# EAGLE design ElectromagnetArray_V01 (EAGLE 9.0.1)
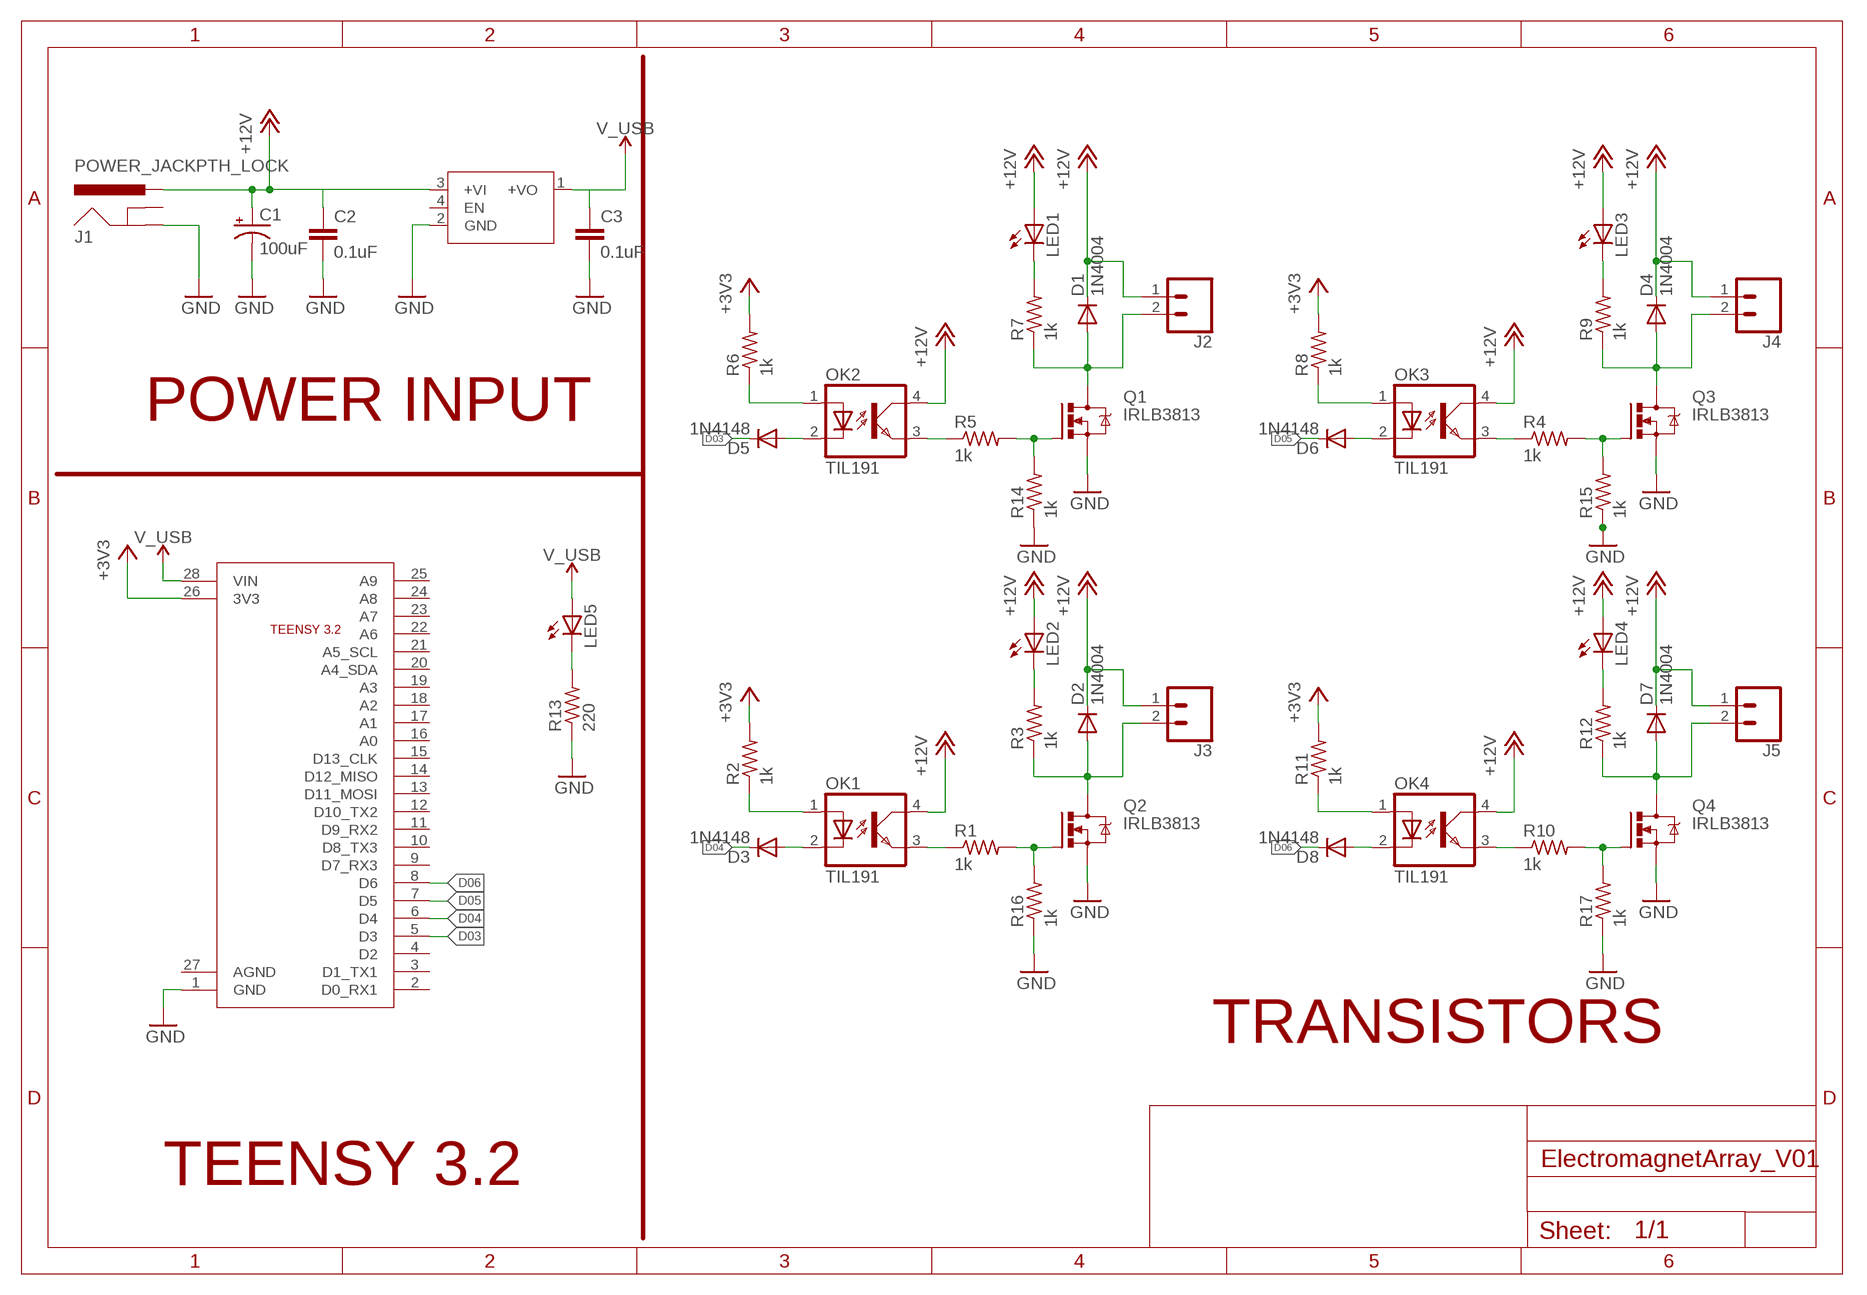
[diagram p0: schematic, sheet 1]

## Parts
C1  100uF  CPOL-USE3.5-8  [E3,5-8]
C2  0.1uF  C-EU050-025X075  [C050-025X075]
C3  0.1uF  C-EU050-025X075  [C050-025X075]
D1  1N4004  [DO41-10]
D2  1N4004  [DO41-10]
D3  1N4148  1N4148DO35-10  [DO35-10]
D4  1N4004  [DO41-10]
D5  1N4148  1N4148DO35-10  [DO35-10]
D6  1N4148  1N4148DO35-10  [DO35-10]
D7  1N4004  [DO41-10]
D8  1N4148  1N4148DO35-10  [DO35-10]
J1  POWER_JACKPTH_LOCK  [POWER_JACK_PTH_LOCK]
J2  CONN_025MM  [SCREWTERMINAL-5MM-2]
J3  CONN_025MM  [SCREWTERMINAL-5MM-2]
J4  CONN_025MM  [SCREWTERMINAL-5MM-2]
J5  CONN_025MM  [SCREWTERMINAL-5MM-2]
LED1  LED5MM  [LED5MM]
LED2  LED5MM  [LED5MM]
LED3  LED5MM  [LED5MM]
LED4  LED5MM  [LED5MM]
LED5  LED5MM  [LED5MM]
OK1  TIL191  [DIL04]
OK2  TIL191  [DIL04]
OK3  TIL191  [DIL04]
OK4  TIL191  [DIL04]
Q1  IRLB3813  IRF740  [TO220BV]
Q2  IRLB3813  IRF740  [TO220BV]
Q3  IRLB3813  IRF740  [TO220BV]
Q4  IRLB3813  IRF740  [TO220BV]
R1  1k  R-US_0204/7  [0204/7]
R2  1k  R-US_0204/7  [0204/7]
R3  1k  R-US_0204/7  [0204/7]
R4  1k  R-US_0204/7  [0204/7]
R5  1k  R-US_0204/7  [0204/7]
R6  1k  R-US_0204/7  [0204/7]
R7  1k  R-US_0204/7  [0204/7]
R8  1k  R-US_0204/7  [0204/7]
R9  1k  R-US_0204/7  [0204/7]
R10  1k  R-US_0204/7  [0204/7]
R11  1k  R-US_0204/7  [0204/7]
R12  1k  R-US_0204/7  [0204/7]
R13  220  R-US_0204/7  [0204/7]
R14  1k  R-US_0204/7  [0204/7]
R15  1k  R-US_0204/7  [0204/7]
R16  1k  R-US_0204/7  [0204/7]
R17  1k  R-US_0204/7  [0204/7]
U$1  TEENSY3.2  [TEENSY]
U$2  SMPS_SMALL  [SMPS_SMALL]

## Nets
+3V3: R2.2 R6.2 R8.2 R11.2 U$1.26(3V3)
+12V: C1.+ C2.1 D1.C D2.C D4.C D7.C J1.PWR J2.1 J3.1 J4.1 J5.1 LED1.A LED2.A LED3.A LED4.A OK1.4(COL) OK2.4(COL) OK3.4(COL) OK4.4(COL) U$2.3(+VI)
D03: D5.C U$1.5(D3)
D04: D3.C U$1.6(D4)
D05: D6.C U$1.7(D5)
D06: D8.C U$1.8(D6)
GND: C1.- C2.2 C3.2 J1.GND Q1.S Q2.S Q3.S Q4.S R13.1 R14.1 R15.1 R16.1 R17.1 U$1.1(GND) U$2.2(GND)
N$1: Q1.G R5.2 R14.2
N$2: D2.A J3.2 Q2.D R3.1
N$3: OK1.3(EMIT) R1.1
N$4: OK1.1(A) R2.1
N$5: D3.A OK1.2(C)
N$6: LED2.K(C) R3.2
N$7: Q2.G R1.2 R16.2
N$8: D4.A J4.2 Q3.D R9.1
N$9: D1.A J2.2 Q1.D R7.1
N$10: LED1.K(C) R7.2
N$11: OK3.3(EMIT) R4.1
N$12: OK2.3(EMIT) R5.1
N$13: OK2.1(A) R6.1
N$14: D5.A OK2.2(C)
N$15: OK3.1(A) R8.1
N$16: D6.A OK3.2(C)
N$17: LED3.K(C) R9.2
N$19: D7.A J5.2 Q4.D R12.1
N$20: OK4.3(EMIT) R10.1
N$21: OK4.1(A) R11.1
N$22: D8.A OK4.2(C)
N$23: LED4.K(C) R12.2
N$24: Q4.G R10.2 R17.2
N$25: LED5.K(C) R13.2
N$26: Q3.G R4.2 R15.2
V_USB: C3.1 LED5.A U$1.28(VIN) U$2.1(+VO)
Unconnected: J1.GNDBREAK U$1.2(D0_RX1) U$1.3(D1_TX1) U$1.4(D2) U$1.9(D7_RX3) U$1.10(D8_TX3) U$1.11(D9_RX2) U$1.12(D10_TX2) U$1.13(D11_MOSI) U$1.14(D12_MISO) U$1.15(D13_CLK) U$1.16(A0) U$1.17(A1) U$1.18(A2) U$1.19(A3) U$1.20(A4_SDA) U$1.21(A5_SCL) U$1.22(A6) U$1.23(A7) U$1.24(A8) U$1.25(A9) U$1.27(AGND) U$2.4(EN)

## Notes on the sheet
- POWER INPUT
- TRANSISTORS
- TEENSY 3.2

## Library data of the parts
C1 = rcl:CPOL-US: POLARIZED CAPACITOR, American symbol; SPICEPREFIX: C
C2 C3 = rcl:C-EU: CAPACITOR, European symbol; SPICEPREFIX: C
D1 D2 D4 D7 = diode:1N4004: DIODE general purpose rectifier, 1 A
D3 D5 D6 D8 = diode:1N4148: DIODE high speed (Philips)
J1 = SparkFun-Connectors:POWER_JACK: Power Jack Connector This is the standard 5.5mm barrel jack for power. The PTH is the most common, proven, reliable, footprint. The Slot footprint only works if the mill layer is transmitted to the PCB fab house so be warned. Here are the connectors we sell at SparkFun: DC Barrel Power Jack/Connector <https://www.sparkfun.com/products/119> (PRT-00119) DC Barrel Power Jack/Connector (SMD) <https://www.sparkfun.com/products/12748> (PRT-12748) DC Barrel Jack Adapter - Breadboard Compatible <https://www.sparkfun.com/products/10811> (PRT-10811) It is used on this SparkFun product (and many, many others): SparkFun RedBoard - Programmed with Arduino <https://www.sparkfun.com/products/12757> (DEV-12757) Also, if you need a mating power supply or connector, please check these out: Wall Adapter Power Supply - 9VDC 650mA <https://www.sparkfun.com/products/298> (TOL-00298) DC Barrel Jack Adapter - Male <https://www.sparkfun.com/products/10287> (PRT-10287); PROD_ID: CONN-08197; SF_ID: PRT-00119
J2-J5 = SparkFun-Connectors:CONN_02: Multi connection point. Often used as Generic Header-pin footprint for 0.1 inch spaced/style header connections On any of the 0.1 inch spaced packages, you can populate with these: Break Away Headers - Straight <https://www.sparkfun.com/products/116> (PRT-00116) Break Away Male Headers - Right Angle <https://www.sparkfun.com/products/553> (PRT-00553) Female Headers <https://www.sparkfun.com/products/115> (PRT-00115) Break Away Headers - Machine Pin <https://www.sparkfun.com/products/117> (PRT-00117) Break Away Female Headers - Swiss Machine Pin <https://www.sparkfun.com/products/743> (PRT-00743) For SCREWTERMINALS and SPRING TERMINALS visit here: Screw Terimnals on SparkFun.com <https://www.sparkfun.com/search/results?term=Screw+Terminals> (5mm/3.5mm/2.54mm spacing) This device is also useful as a general connection point to wire up your design to another part of your project. Our various solder wires solder well into these plated through hole pads. Hook-Up Wire - Assortment (Stranded, 22 AWG) <https://www.sparkfun.com/products/11375> (PRT-11375) Hook-Up Wire - Assortment (Solid Core, 22 AWG) <https://www.sparkfun.com/products/11367> (PRT-11367) View the entire wire category on our website here <https://www.sparkfun.com/categories/141> Special notes: Molex polarized connector foot print use with: PRT-08233 with associated crimp pins and housings. 2.54_SCREWTERM for use with PRT-10571. 3.5mm Screw Terminal footprints for PRT-08084 5mm Screw Terminal footprints for use with PRT-08432; SF_SKU: PRT-08432
LED1-LED5 = led:LED: LED OSRAM: - CHIPLED LG R971, LG N971, LY N971, LG Q971, LY Q971, LO R971, LY R971 LH N974, LH R974 LS Q976, LO Q976, LY Q976 LO Q996 - Hyper CHIPLED LW Q18S LB Q993, LB Q99A, LB R99A - SideLED LS A670, LO A670, LY A670, LG A670, LP A670 LB A673, LV A673, LT A673, LW A673 LH A674 LY A675 LS A676, LA A676, LO A676, LY A676, LW A676 LS A679, LY A679, LG A679 - Hyper Micro SIDELED® LS Y876, LA Y876, LO Y876, LY Y876 LT Y87S - SmartLED LW L88C, LW L88S LB L89C, LB L89S, LG L890 LS L89K, LO L89K, LY L89K LS L896, LA L896, LO L896, LY L896 - TOPLED LS T670, LO T670, LY T670, LG T670, LP T670 LSG T670, LSP T670, LSY T670, LOP T670, LYG T670 LG T671, LOG T671, LSG T671 LB T673, LV T673, LT T673, LW T673 LH T674 LS T676, LA T676, LO T676, LY T676, LB T676, LH T676, LSB T676, LW T676 LB T67C, LV T67C, LT T67C, LS T67K, LO T67K, LY T67K, LW E67C LS E67B, LA E67B, LO E67B, LY E67B, LB E67C, LV E67C, LT E67C LW T67C LS T679, LY T679, LG T679 LS T770, LO T770, LY T770, LG T770, LP T770 LB T773, LV T773, LT T773, LW T773 LH T774 LS E675, LA E675, LY E675, LS T675 LS T776, LA T776, LO T776, LY T776, LB T776 LHGB T686 LT T68C, LB T68C - Hyper Mini TOPLED® LB M676 - Mini TOPLED Santana® LG M470 LS M47K, LO M47K, LY M47K Source: http://www.osram.convergy.de LUXEON: - LUMILED® LXK2-PW12-R00, LXK2-PW12-S00, LXK2-PW14-U00, LXK2-PW14-V00 LXK2-PM12-R00, LXK2-PM12-S00, LXK2-PM14-U00 LXK2-PE12-Q00, LXK2-PE12-R00, LXK2-PE12-S00, LXK2-PE14-T00, LXK2-PE14-U00 LXK2-PB12-K00, LXK2-PB12-L00, LXK2-PB12-M00, LXK2-PB14-N00, LXK2-PB14-P00, LXK2-PB14-Q00 LXK2-PR12-L00, LXK2-PR12-M00, LXK2-PR14-Q00, LXK2-PR14-R00 LXK2-PD12-Q00, LXK2-PD12-R00, LXK2-PD12-S00 LXK2-PH12-R00, LXK2-PH12-S00 LXK2-PL12-P00, LXK2-PL12-Q00, LXK2-PL12-R00 Source: www.luxeon.com KINGBRIGHT: KA-3528ASYC Source: www.kingbright.com
OK1-OK4 = optocoupler:TIL191: TEXAS INSTRUMENTS OPTO COUPLER; OC_FARNELL: 1683363; OC_NEWARK: unknown
Q1-Q4 = transistor-power:IRF740: N-CHANNEL MOS FET
R1-R17 = rcl:R-US_: RESISTOR, American symbol; SPICEPREFIX: R
U$1 = EzerLonginus:TEENSY
U$2 = EzerLonginus:SMPS_SMALL

## Board
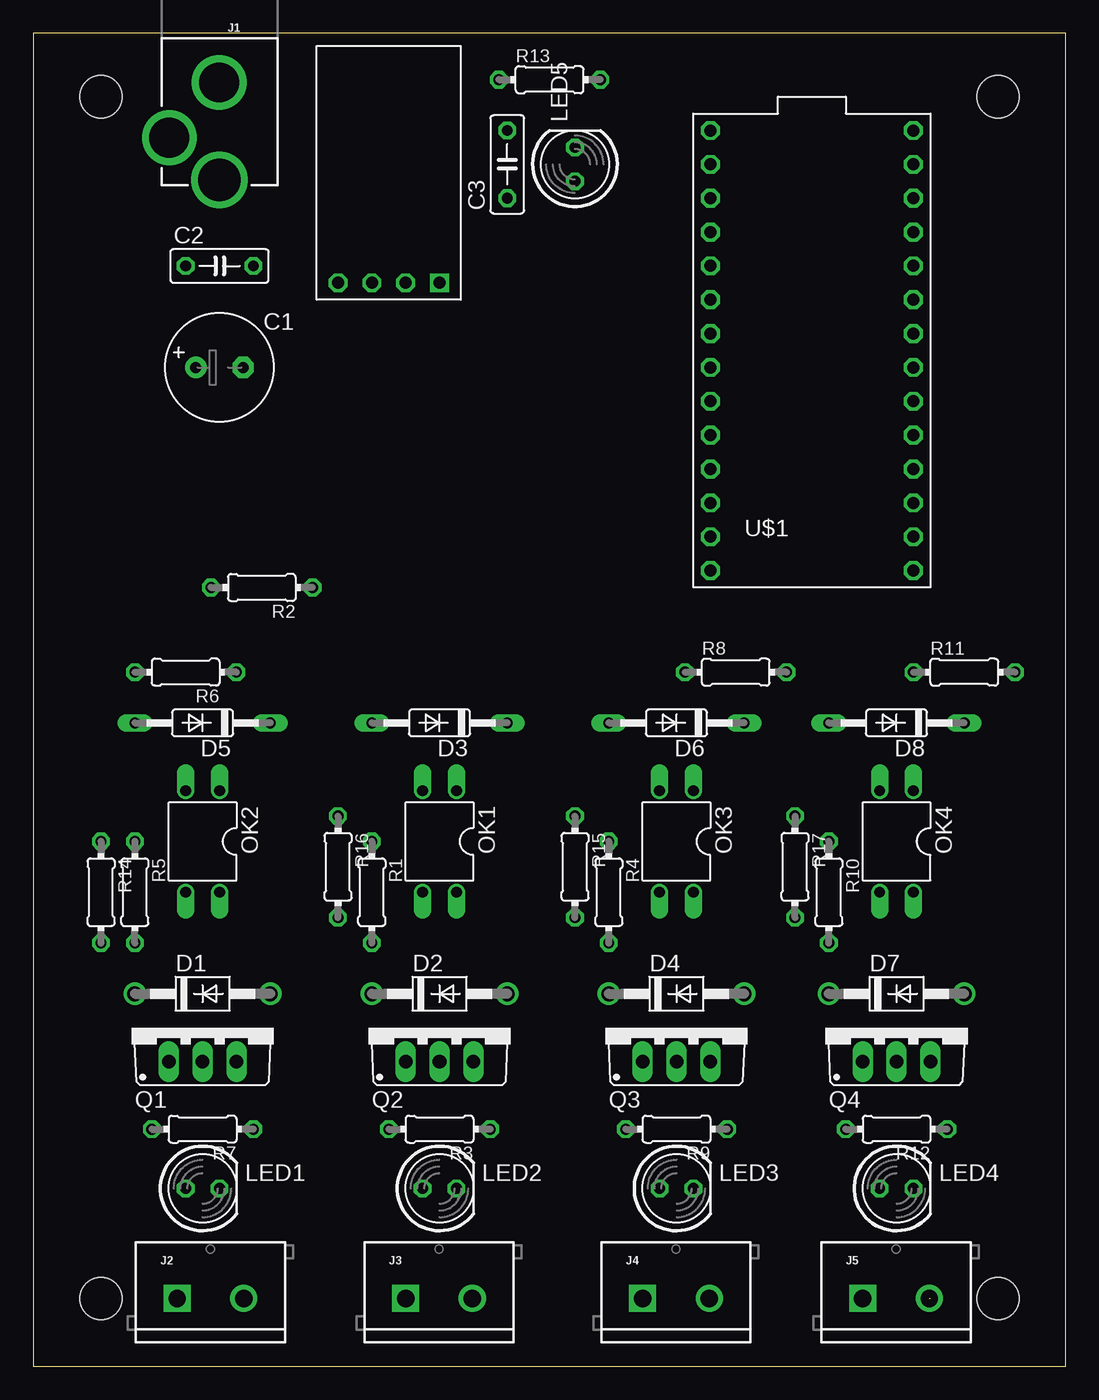
[diagram p1: board, top side]
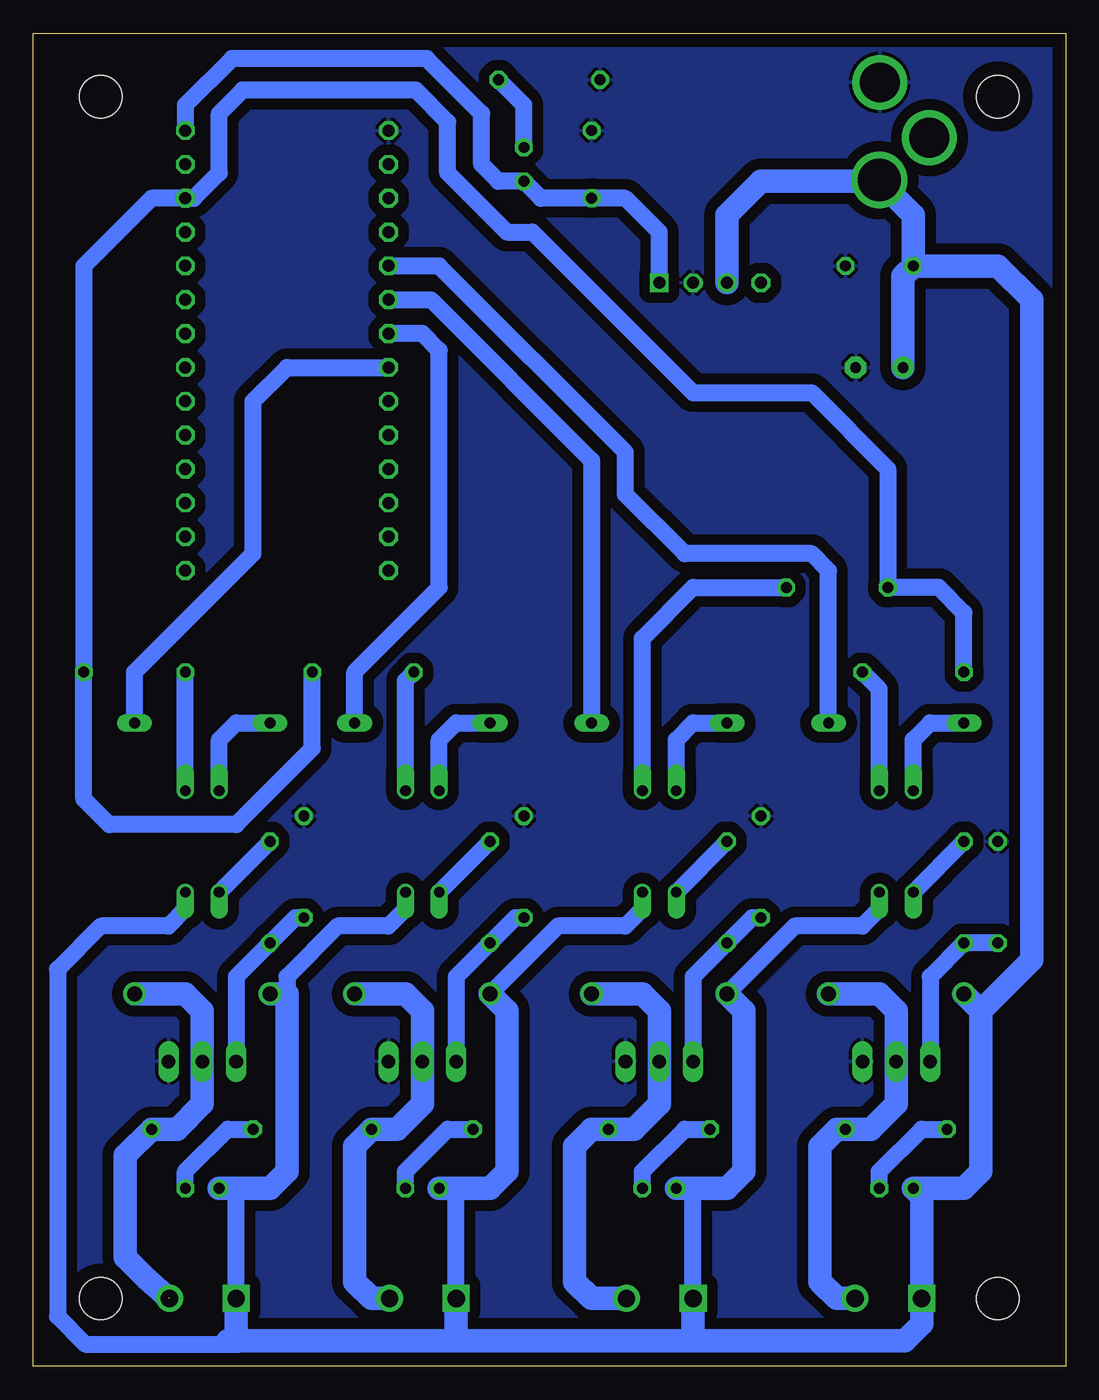
[diagram p2: board, bottom side, seen from below]

Size 77.45 x 100 mm. Coordinates in mm from the lower left corner, seen from the top.
Outline: 0,0 77.45,0 77.45,100 0,100 0,0
Copper layers (1*16): Top 0.035mm / dielectric 1.5mm / Bottom 0.035mm
Design rules "default": minimum track width 6mil, minimum drill 0.35mm, track to track 6mil, track to pad 6mil, pad to pad 6mil, via to via 6mil, smd to smd 6mil, copper to edge 40mil, drill to drill 6mil, minimum pad ring 10mil, minimum via ring 8mil, stop-mask expansion 4mil, vias tented up to drill 0mil, thermal gap 10mil
Holes 3.17 mm at 5.08,95.25 5.08,5.08 72.39,5.08 72.39,95.25

### Footprints (pad centres in the part's own frame; a part is rotated, then mirrored left to right if it is on the bottom)
E3,5-8 = drill 0.813 pad 1.6: + -1.778,0 | drill 0.813 pad 1.6 octagon: - 1.778,0
C050-025X075 = drill 0.813 octagon: 1 -2.54,0; 2 2.54,0
DO41-10 = drill 1.118: A 5.08,0; C -5.08,0
DO35-10 = drill 0.813 long: A 5.08,0; C -5.08,0
POWER_JACK_PTH_LOCK = drill 2.997 pad 4.115: GND 0.025,6.557; GNDBREAK 3.762,10.7 | drill 3.2 pad 4.115: PWR 0,13.878
SCREWTERMINAL-5MM-2 = drill 1.3 pad 2.032 square: 1 0,0 | drill 1.3 pad 2.032: 2 5,0
LED5MM = drill 0.813 octagon: A -1.27,0; K 1.27,0
DIL04 = drill 0.813 offset: 1 -1.27,-3.81; 2 1.27,-3.81; 3 1.27,3.81; 4 -1.27,3.81
TO220BV = drill 1.016 long: D 0,-2.54; G -2.54,-2.54; S 2.54,-2.54
0204/7 = drill 0.813 octagon: 1 -3.81,0; 2 3.81,0
TEENSY = drill 0.9 octagon: 1 -7.62,17.78; 2 -7.62,15.24; 3 -7.62,12.7; 4 -7.62,10.16; 5 -7.62,7.62; 6 -7.62,5.08; 7 -7.62,2.54; 8 -7.62,0; 9 -7.62,-2.54; 10 -7.62,-5.08; 11 -7.62,-7.62; 12 -7.62,-10.16; 13 -7.62,-12.7; 14 -7.62,-15.24; 15 7.62,-15.24; 16 7.62,-12.7; 17 7.62,-10.16; 18 7.62,-7.62; 19 7.62,-5.08; 20 7.62,-2.54; 21 7.62,0; 22 7.62,2.54; 23 7.62,5.08; 24 7.62,7.62; 25 7.62,10.16; 26 7.62,12.7; 27 7.62,15.24; 28 7.62,17.78
SMPS_SMALL = drill 0.9 square: 1 -3.81,0 | drill 0.9 octagon: 2 -1.27,0; 3 1.27,0; 4 3.81,0

### Placement (x,y rotation side)
C1  13.97,74.93 0 top
C2  13.97,82.55 0 top
C3  35.56,90.17 90 top
D1  12.7,27.94 0 top
D2  30.48,27.94 0 top
D3  30.48,48.26 180 top
D4  48.26,27.94 0 top
D5  12.7,48.26 180 top
D6  48.26,48.26 180 top
D7  64.77,27.94 0 top
D8  64.77,48.26 180 top
J1  13.97,102.87 180 top
J2  10.79,5.08 0 top
J3  27.94,5.08 0 top
J4  45.72,5.08 0 top
J5  62.23,5.08 0 top
LED1  12.7,13.34 0 top
LED2  30.48,13.34 0 top
LED3  48.26,13.34 0 top
LED4  64.77,13.34 0 top
LED5  40.64,90.17 90 top
OK1  30.48,39.37 180 top
OK2  12.7,39.37 180 top
OK3  48.26,39.37 180 top
OK4  64.77,39.37 180 top
Q1  12.7,25.4 0 top
Q2  30.48,25.4 0 top
Q3  48.26,25.4 0 top
Q4  64.77,25.4 0 top
R1  25.4,35.56 270 top
R2  17.14,58.42 180 top
R3  30.48,17.78 180 top
R4  43.18,35.56 270 top
R5  7.62,35.56 270 top
R6  11.43,52.07 180 top
R7  12.7,17.78 180 top
R8  52.7,52.07 0 top
R9  48.26,17.78 180 top
R10  59.69,35.56 270 top
R11  69.85,52.07 0 top
R12  64.77,17.78 180 top
R13  38.73,96.52 0 top
R14  5.08,35.56 270 top
R15  40.64,37.47 270 top
R16  22.86,37.47 270 top
R17  57.15,37.47 270 top
U$1  58.42,74.93 0 top
U$2  26.67,81.28 180 top

### Tracks (layer width: path | path; a pad name or v marks a point on that pad's centre or on a via)
+3V3
  Bottom 1.27: R6.2 7.62,56.52 9.53,58.42 R2.2 13.34,67.31 19.05,73.03 27.94,73.03 40.01,85.09 41.91,85.09 46.35,89.53 46.35,93.34 48.74,95.73 61.75,95.73 63.5,93.98 63.5,89.53 65.41,87.63 U$1.26 68.58,87.63 73.66,82.55 R11.2 73.66,42.55 71.75,40.64 62.23,40.64 56.52,46.35 R8.2
+12V
  Bottom 1.27: OK2.4 13.97,34.29 15.24,33.02 20.32,33.02 D2.C | OK1.4 31.75,34.29 33.02,33.02 38.1,33.02 D4.C | OK3.4 49.53,34.29 50.8,33.02 54.61,33.02 58.42,29.21 58.42,27.94 | OK4.4 66.04,34.29 67.31,33.02 72.39,33.02 75.63,29.78 75.63,3.74 73.54,1.65 61.98,1.65 | 60.96,1.65 61.98,1.65 | 61.98,1.65 62.23,1.91 | J4.1 45.72,13.34 | J5.1 62.23,13.34 | J3.1 27.94,13.34
  Bottom 1.778: D1.C 6.35,26.67 | 6.35,26.67 6.35,14.61 7.62,13.34 LED1.A 10.79,12.7 J2.1 10.79,3.17 12.06,1.91 27.94,1.91 | 27.94,1.91 45.72,1.91 | 45.72,1.91 62.23,1.91 | 62.23,1.91 62.87,1.91 | D2.C 24.13,26.67 24.13,14.61 25.4,13.34 27.94,13.34 LED2.A | D4.C 41.91,26.67 41.91,14.61 43.18,13.34 45.72,13.34 LED3.A | D7.C 58.42,27.94 58.42,14.61 59.69,13.34 62.23,13.34 LED4.A | 13.97,88.9 22.86,88.9 25.4,86.36 U$2.3 | 13.97,88.9 J1.PWR | C2.1 11.43,86.36 13.97,88.9 | C2.1 5.08,82.55 2.54,80.01 2.54,30.48 6.35,26.67 | C1.+ 12.19,81.79 C2.1 | J3.1 27.94,1.91 | J4.1 45.72,1.91 | J5.1 62.23,1.91
D03
  Bottom 1.27: U$1.5 46.99,82.55 33.02,68.58 33.02,65.41 28.57,60.96 19.05,60.96 17.78,59.69 D5.C
D04
  Bottom 1.27: D3.C 35.56,67.94 47.62,80.01 U$1.6
D05
  Bottom 1.27: D6.C 53.34,52.07 46.99,58.42 46.99,76.2 48.26,77.47 U$1.7
D06
  Bottom 1.27: D8.C 69.85,52.07 60.96,60.96 60.96,72.39 58.42,74.93 U$1.8
GND
  pour Bottom (isolate 0.813): 0,100.33 77.47,100.33 77.47,0 0,0
N$1
  Bottom 1.27: Q1.G 10.16,29.21 R5.2 R14.2
N$2
  Bottom 1.778: D2.A 31.75,27.94 30.48,26.67 Q2.D 30.48,19.68 32.38,17.78 R3.1 35.56,17.78 36.83,16.51 36.83,6.35 35.56,5.08 J3.2
N$3
  Bottom 1.27: R1.1 OK1.3
N$4
  Bottom 1.27: OK1.1 31.75,54.61 27.94,58.42 R2.1
N$5
  Bottom 1.27: OK1.2 29.21,46.99 27.94,48.26 D3.A
N$6
  Bottom 1.27: LED2.K 31.75,14.61 28.57,17.78 R3.2
N$7
  Bottom 1.27: Q2.G 27.94,29.21 R1.2 23.5,33.66 R16.2
N$8
  Bottom 1.778: D4.A 49.53,27.94 48.26,26.67 Q3.D 48.26,19.68 50.16,17.78 R9.1 53.34,16.51 53.34,6.35 52.07,5.08 J4.2
N$9
  Bottom 1.778: D1.A 13.97,27.94 12.7,26.67 Q1.D 12.7,19.68 14.61,17.78 R7.1 17.14,17.78 18.41,16.51 18.41,6.35 17.14,5.08 J2.2
N$10
  Bottom 1.27: LED1.K 13.97,14.61 10.79,17.78 R7.2
N$11
  Bottom 1.27: R4.1 OK3.3
N$12
  Bottom 1.27: R5.1 OK2.3
N$13
  Bottom 1.27: OK2.1 13.97,50.8 R6.1
N$14
  Bottom 1.27: D5.A 10.16,48.26 11.43,46.99 OK2.2
N$15
  Bottom 1.27: OK3.1 49.53,49.53 49.53,51.44 R8.1
N$16
  Bottom 1.27: OK3.2 46.99,46.99 45.72,48.26 D6.A
N$17
  Bottom 1.27: LED3.K 49.53,14.61 46.35,17.78 R9.2
N$19  (1 unrouted)
  Bottom 1.778: D7.A 66.04,27.94 64.77,26.67 Q4.D 64.77,19.68 66.67,17.78 R12.1 70.56,15.8 70.56,8.19 68.9,6.53 67.63,5.4 67.31,5.08
N$20
  Bottom 1.27: R10.1 OK4.3
N$21
  Bottom 1.27: OK4.1 R11.1
N$22
  Bottom 1.27: D8.A 62.23,48.26 63.5,46.99 OK4.2
N$23
  Bottom 1.27: LED4.K 66.04,14.61 62.87,17.78 R12.2
N$24
  Bottom 1.27: Q4.G 62.23,29.21 R10.2 57.78,33.66 R17.2
N$25
  Bottom 1.27: LED5.K 40.64,94.61 R13.2
N$26
  Bottom 1.27: Q3.G 45.72,29.21 R4.2 41.27,33.66 R15.2
V_USB
  Bottom 1.27: U$2.1 30.48,85.09 33.02,87.63 C3.1 39.37,87.63 LED5.A 42.55,88.9 43.81,90.17 43.81,93.98 47.94,98.11 62.55,98.11 66.04,94.61 U$1.28